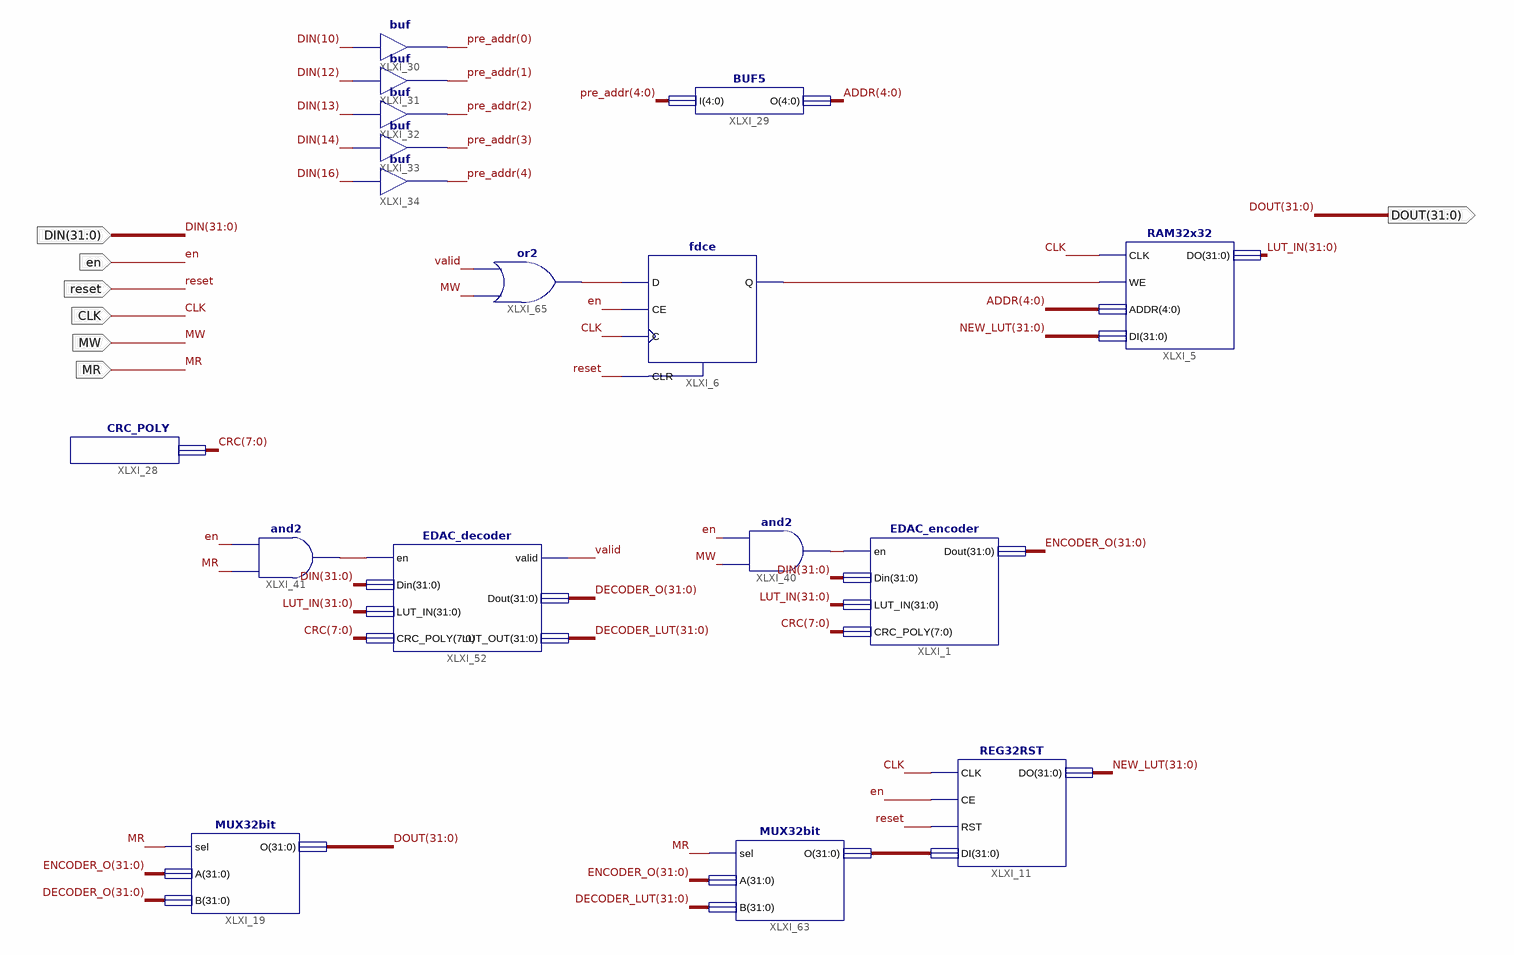
[diagram p0: schematic sheet 1]
// Xilinx ISE schematic EDAC_ENV.sch (spartan6) as structural Verilog: 17 symbols, 7 ports
module EDAC_ENV (
  input  [31:0] DIN,
  input  MR,
  input  en,
  input  MW,
  input  CLK,
  input  reset,
  output [31:0] DOUT
);

  wire valid, XLXN_52, XLXN_192, XLXN_193, XLXN_236;
  wire [4:0] ADDR, pre_addr;
  wire [7:0] CRC;
  wire [31:0] DECODER_LUT, DECODER_O, ENCODER_O, LUT_IN, NEW_LUT, XLXN_230;

  REG32RST XLXI_11 (.CLK(CLK), .CE(en), .RST(reset), .DI(XLXN_230), .DO(NEW_LUT));
  MUX32bit XLXI_19 (.sel(MR), .A(ENCODER_O), .B(DECODER_O), .O(DOUT));
  CRC_POLY XLXI_28 (.O(CRC));
  buf XLXI_30 (pre_addr[0], DIN[10]);
  buf XLXI_31 (pre_addr[1], DIN[12]);
  buf XLXI_32 (pre_addr[2], DIN[13]);
  buf XLXI_33 (pre_addr[3], DIN[14]);
  buf XLXI_34 (pre_addr[4], DIN[16]);
  BUF5 XLXI_29 (.I(pre_addr), .O(ADDR));
  RAM32x32 XLXI_5 (.CLK(CLK), .WE(XLXN_52), .ADDR(ADDR), .DI(NEW_LUT), .DO(LUT_IN));
  MUX32bit XLXI_63 (.sel(MR), .A(ENCODER_O), .B(DECODER_LUT), .O(XLXN_230));
  fdce XLXI_6 (.C(CLK), .CE(en), .CLR(reset), .D(XLXN_236), .Q(XLXN_52));
  or XLXI_65 (XLXN_236, MW, valid);
  and XLXI_40 (XLXN_193, MW, en);
  and XLXI_41 (XLXN_192, MR, en);
  EDAC_encoder XLXI_1 (.en(XLXN_193), .Din(DIN), .LUT_IN(LUT_IN), .CRC_POLY(CRC), .Dout(ENCODER_O));
  EDAC_decoder XLXI_52 (
    .en(XLXN_192), .Din(DIN), .LUT_IN(LUT_IN), .CRC_POLY(CRC), .valid(valid), .Dout(DECODER_O),
    .LUT_OUT(DECODER_LUT));
endmodule
